# Altium schematic sheet MezzanineDCDC_8033.SchDoc: Mezzanine DCDC PCB - LTM8033
size B; Date: 9/7/2021; Engineer: J. Juneau; DocumentNumber: 1006; Revision: 1.2; SheetNumber: 3; SheetTotal: 4
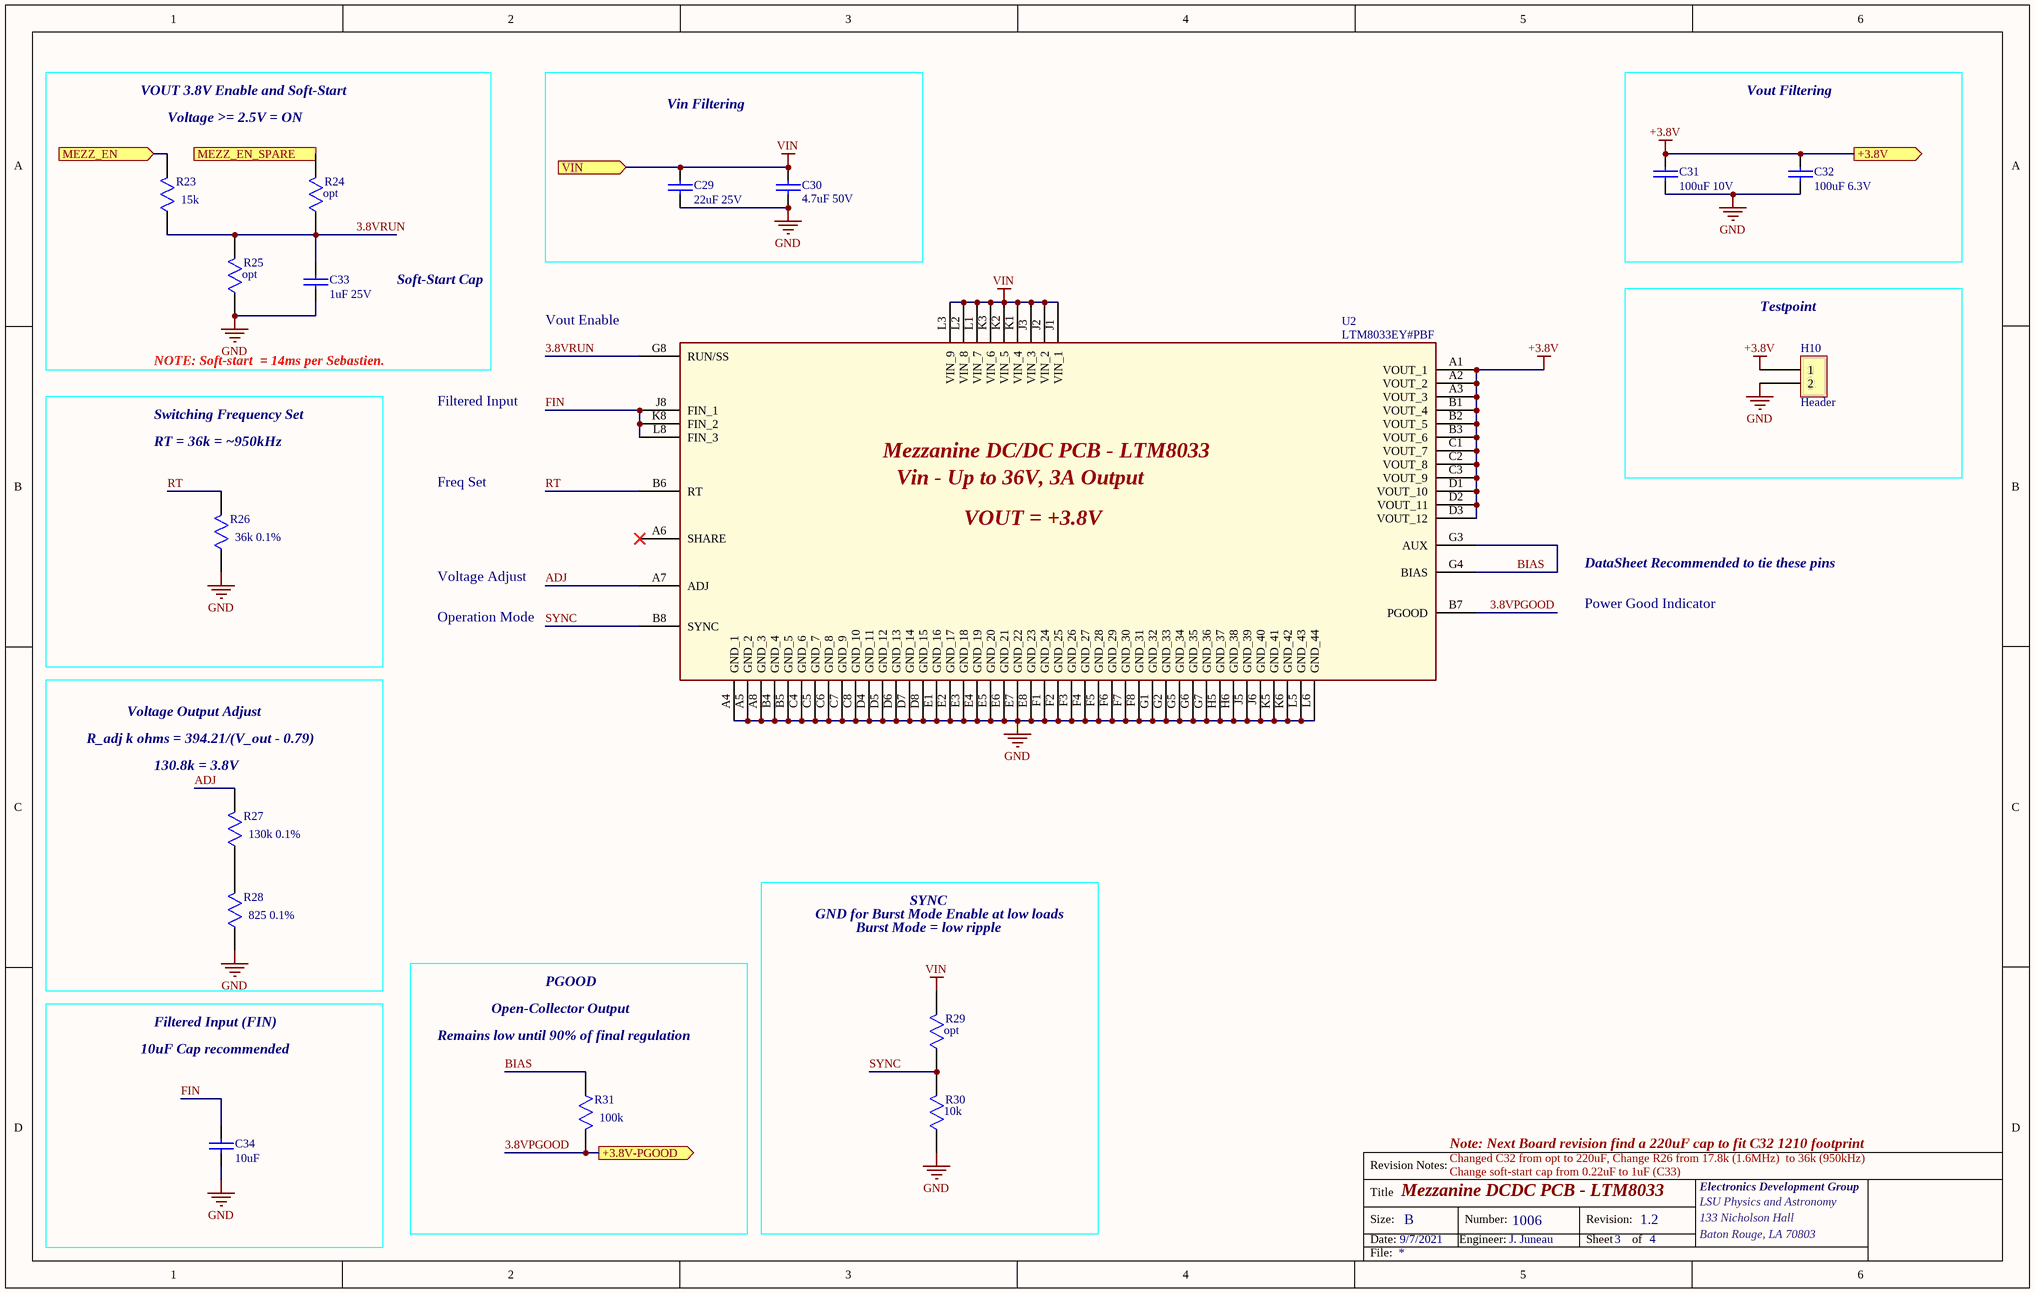
[diagram p0: MezzanineDCDC_8033.SchDoc]

## Parts
C29  value 22uF 25V  [CAP 1210 Murata]  (hidden comment: GRM32ER61E226KE15L)
C30  value 4.7uF 50V  [CAP 1206 TDK]  (hidden comment: UMK316BJ475KL-T)
C31  value 100uF 10V  [CAP 1210 Murata]  (hidden comment: LMK325BJ107MM-T)
C32  value 100uF 6.3V  [CAP 1210 Murata]  (hidden comment: GRM31CR60J227ME11L)
C33  value 1uF 25V  [Cap 0603 TDK]  (hidden comment: 06033C105KAT4A)
C34  value 10uF  [CAP 1210 Murata]  (hidden comment: GRM32ER71H106KA12L)
H10  Header  [Header 2Pin]
R23  value 15k  [Resistor ERJ2G/CRCW 0402]  (hidden comment: ERJ-U02F1502X)
R24  opt  [Resistor ERJ2G/CRCW 0402]
R25  opt  [Resistor ERJ2G/CRCW 0402]
R26  value 36k 0.1%  [Resistor 0603 - ERJ]  (hidden comment: ERA-3APB363V)
R27  value 130k 0.1%  [Resistor 0603 - ERJ]  (hidden comment: ERA-3AEB134V)
R28  value 825 0.1%  [Resistor 0603 - ERJ]  (hidden comment: ERA-3AEB8250V)
R29  opt  [Resistor ERJ2G/CRCW 0402]
R30  value 10k  [Resistor ERJ2G/CRCW 0402]  (hidden comment: ERJ-2GEJ103X)
R31  value 100k  [Resistor ERJ2G/CRCW 0402]  (hidden comment: ERJ-2RKF1003X)
U2  LTM8033EY#PBF  [LTM8033 BGA]

## Blocks framed on the sheet
Vin Filtering: C29 C30
Vout Filtering: C31 C32
Testpoint: H10

## Ports
+3.8V (out), +3.8V-PGOOD (out), MEZZ_EN (in), MEZZ_EN_SPARE (in), VIN (in)

## Nets
+3.8V: C31.1 C32.1 H10.1 U2.A1(VOUT_1) U2.A2(VOUT_2) U2.A3(VOUT_3) U2.B1(VOUT_4) U2.B2(VOUT_5) U2.B3(VOUT_6) U2.C1(VOUT_7) U2.C2(VOUT_8) U2.C3(VOUT_9) U2.D1(VOUT_10) U2.D2(VOUT_11) U2.D3(VOUT_12) ; port +3.8V
GND: C29.2 C30.2 C31.2 C32.2 C33.2 C34.2 H10.2 R25.1 R26.1 R28.1 R30.1 U2.A4(GND_1) U2.A5(GND_2) U2.A8(GND_3) U2.B4(GND_4) U2.B5(GND_5) U2.C4(GND_6) U2.C5(GND_7) U2.C6(GND_8) U2.C7(GND_9) U2.C8(GND_10) U2.D4(GND_11) U2.D5(GND_12) U2.D6(GND_13) U2.D7(GND_14) U2.D8(GND_15) U2.E1(GND_16) U2.E2(GND_17) U2.E3(GND_18) U2.E4(GND_19) U2.E5(GND_20) U2.E6(GND_21) U2.E7(GND_22) U2.E8(GND_23) U2.F1(GND_24) U2.F2(GND_25) U2.F3(GND_26) U2.F4(GND_27) U2.F5(GND_28) U2.F6(GND_29) U2.F7(GND_30) U2.F8(GND_31) U2.G1(GND_32) U2.G2(GND_33) U2.G5(GND_34) U2.G6(GND_35) U2.G7(GND_36) U2.H5(GND_37) U2.H6(GND_38) U2.J5(GND_39) U2.J6(GND_40) U2.K5(GND_41) U2.K6(GND_42) U2.L5(GND_43) U2.L6(GND_44)
VIN: C29.1 C30.1 R29.2 U2.J1(VIN_1) U2.J2(VIN_2) U2.J3(VIN_3) U2.K1(VIN_4) U2.K2(VIN_5) U2.K3(VIN_6) U2.L1(VIN_7) U2.L2(VIN_8) U2.L3(VIN_9) ; port VIN
3.8VPGOOD: R31.2 U2.B7(PGOOD) ; port +3.8V-PGOOD
3.8VRUN: C33.1 R23.1 R24.1 R25.2 U2.G8(RUN/SS)
ADJ: R27.2 U2.A7(ADJ)
BIAS: R31.1 U2.G3(AUX) U2.G4(BIAS)
FIN: C34.1 U2.J8(FIN_1) U2.K8(FIN_2) U2.L8(FIN_3)
MEZZ_EN: R23.2 ; port MEZZ_EN
MEZZ_EN_SPARE: R24.2 ; port MEZZ_EN_SPARE
RT: R26.2 U2.B6(RT)
SYNC: R29.1 R30.2 U2.B8(SYNC)
NetR27_1: R27.1 R28.2

Not connected (* = marked no-connect by the designer): U2 A6(SHARE)*

## Notes on the sheet
- VOUT 3.8V Enable and Soft-Start
- Voltage >= 2.5V = ON
- Soft-Start Cap
- NOTE: Soft-start  = 14ms per Sebastien.
- Vout Enable
- Switching Frequency Set
- Filtered Input
- RT = 36k = ~950kHz
- Freq Set
- (near U2) Mezzanine DC/DC PCB - LTM8033
- (near U2) Vin - Up to 36V, 3A Output
- (near U2) VOUT = +3.8V
- DataSheet Recommended to tie these pins
- Voltage Adjust
- Operation Mode
- Power Good Indicator
- R_adj k ohms = 394.21/(V_out - 0.79)
- Voltage Output Adjust
- (near R27) 130.8k = 3.8V
- SYNC
- GND for Burst Mode Enable at low loads
- Burst Mode = low ripple
- Filtered Input (FIN)
- (near R31) Remains low until 90% of final regulation
- Open-Collector Output
- PGOOD
- 10uF Cap recommended
- Changed C32 from opt to 220uF, Change R26 from 17.8k (1.6MHz)  to 36k (950kHz)
- Note: Next Board revision find a 220uF cap to fit C32 1210 footprint
- Change soft-start cap from 0.22uF to 1uF (C33)
- Revision Notes:
- Title
- Size:
- Date:
- B
- Engineer:
- Number:
- Revision:
- Sheet
- of
- Electronics Development Group
- LSU Physics and Astronomy
- 133 Nicholson Hall
- Baton Rouge, LA 70803
- File:

## Library data of the parts
C29 = Capacitor 1210: 22µF ±10% 25V Ceramic Capacitor X5R 1210 (3225 Metric); ComponentLink1Description: Digikey; ComponentLink1URL: https://www.digikey.com/en/products/detail/murata-electronics/GRM32ER61E226KE15L/965903?s=N4IgTCBcDaIOICUCyBmMBRBA2AjOsYWA0ujgKwAyIAugL5A
C30 = Capacitor 1206: 4.7µF ±10% 50V Ceramic Capacitor X5R 1206 (3216 Metric); Dimensions: 3.2x1.6x1.8mm; ComponentLink1Description: Digikey; ComponentLink1URL: https://www.digikey.com/en/products/detail/taiyo-yuden/UMK316BJ475KL-T/1646591?s=N4IgTCBcDaIKoFkDSBmAjANgEICkAsA7AKxIAyAtACogC6AvkA
C31 = Capacitor 1210: CAP CER 100UF 10V X5R 1210; ComponentLink1Description: Digikey; ComponentLink1URL: https://www.digikey.com/en/products/detail/taiyo-yuden/LMK325BJ107MM-T/1646594?s=N4IgTCBcDaIDIFkDSBmMBWAQgKQIwAYB2BBAWgBUQBdAXyA
C32 = Capacitor 1210: 220 µF ±20% 6.3V Ceramic Capacitor X5R 1206 (3216 Metric); ComponentLink1Description: Digikey; ComponentLink1URL: https://www.digikey.com/en/products/detail/murata-electronics/GRM31CR60J227ME11L/6155740
C33 = Capacitor 0603 TDK: 1 µF ±10% 25V Ceramic Capacitor X7R 0603 (1608 Metric); ComponentLink1Description: Digikey; ComponentLink1URL: https://www.digikey.com/en/products/detail/avx-corporation/06033C105KAT4A/8107677?s=N4IgTCBcDaIAwDY4GZkGMCMcCsBrAhgC4As%2BIAugL5A
C34 = Capacitor 1210: CAP CER 10UF 50V X7R 1210; ComponentLink1Description: Digikey; ComponentLink1URL: https://www.digikey.com/en/products/detail/murata-electronics/GRM32ER71H106KA12L/2548481?s=N4IgTCBcDaIOICUCyBmMBRBB2AjACRwAYA2AaQEEcwAZEAXQF8g
H10 = Header - 2Pin: Connector Header Through Hole 2 position 0.100" (2.54mm); ComponentLink1Description: Digikey; ComponentLink1URL: https://www.digikey.com/en/products/detail/amphenol-icc-fci/68001-202HLF/2023308
R23 = ERJ2G Resistor 0402: RES 15K OHM 1% 1/10W 0402 SMD; ComponentLink1Description: Digikey; ComponentLink1URL: https://www.digikey.com/en/products/detail/panasonic-electronic-components/ERJ-U02F1502X/11630567?s=N4IgTCBcDaIKICUBSBaAqgBjAMQIwFYsANEAXQF8g
R24 R25 R29 = ERJ2G Resistor 0402: Resistor 0402; Value: opt
R26 = Resistor 0603: 36 kOhms ±0.1% 0.1W, 1/10W Chip Resistor 0603 (1608 Metric) Automotive AEC-Q200 Thin Film; ComponentLink1Description: Digikey; ComponentLink1URL: https://www.digikey.com/en/products/detail/panasonic-electronic-components/ERA-3APB363V/3070649?s=N4IgTCBcDaIKICUCCBaAzAQwA4CM0DY0A3EAXQF8g
R27 = Resistor 0603: RES SMD 130K OHM 0.1% 1/10W 0603; ComponentLink1Description: Digikey; ComponentLink1URL: https://www.digikey.com/en/products/detail/panasonic-electronic-components/ERA-3AEB134V/1465905?s=N4IgTCBcDaIKICUCCBaAzEuAhAjGgLAGogC6AvkA
R28 = Resistor 0603: RES SMD 825 OHM 0.1% 1/10W 0603; ComponentLink1Description: Digikey; ComponentLink1URL: https://www.digikey.com/en/products/detail/panasonic-electronic-components/ERA-3AEB8250V/2026741?s=N4IgTCBcDaIKICUCCBaAzEuAhAHGArAAwBqIAugL5A
R30 = ERJ2G Resistor 0402: RES SMD 10K OHM 5% 1/10W 0402; ComponentLink1Description: Digikey; ComponentLink1URL: https://www.digikey.com/en/products/detail/panasonic-electronic-components/ERJ-2GEJ103X/146735?s=N4IgTCBcDaIKICUBSBaMBxOSCMAGAzABogC6AvkA
R31 = ERJ2G Resistor 0402: RES SMD 100K OHM 1% 1/10W 0402; ComponentLink1Description: Digikey; ComponentLink1URL: https://www.digikey.com/en/products/detail/panasonic-electronic-components/ERJ-2RKF1003X/192081?s=N4IgTCBcDaIKICUBSBaMCDSAxAjABjwGYANEAXQF8g
U2 = LTM8033: Non-Isolated PoL Module DC DC Converter Output 0.8 ~ 24V - - 3A 3.6V - 36V Input; ComponentLink1Description: Digikey; ComponentLink1URL: https://www.digikey.com/en/products/detail/analog-devices-inc/LTM8033EY-PBF/4964717